# Altium schematic sheet Top.SchDoc
size Letter; DocumentNumber: 1; SheetNumber: 1; SheetTotal: 1; SPICEModelCacheXCQKSQWO: <root> / <DocumentId>XCQKSQWO</DocumentId> / </root>; DescLong1: Class: ESE3400; DescLong2_DescShort: Biopotential Amplifier for ECG
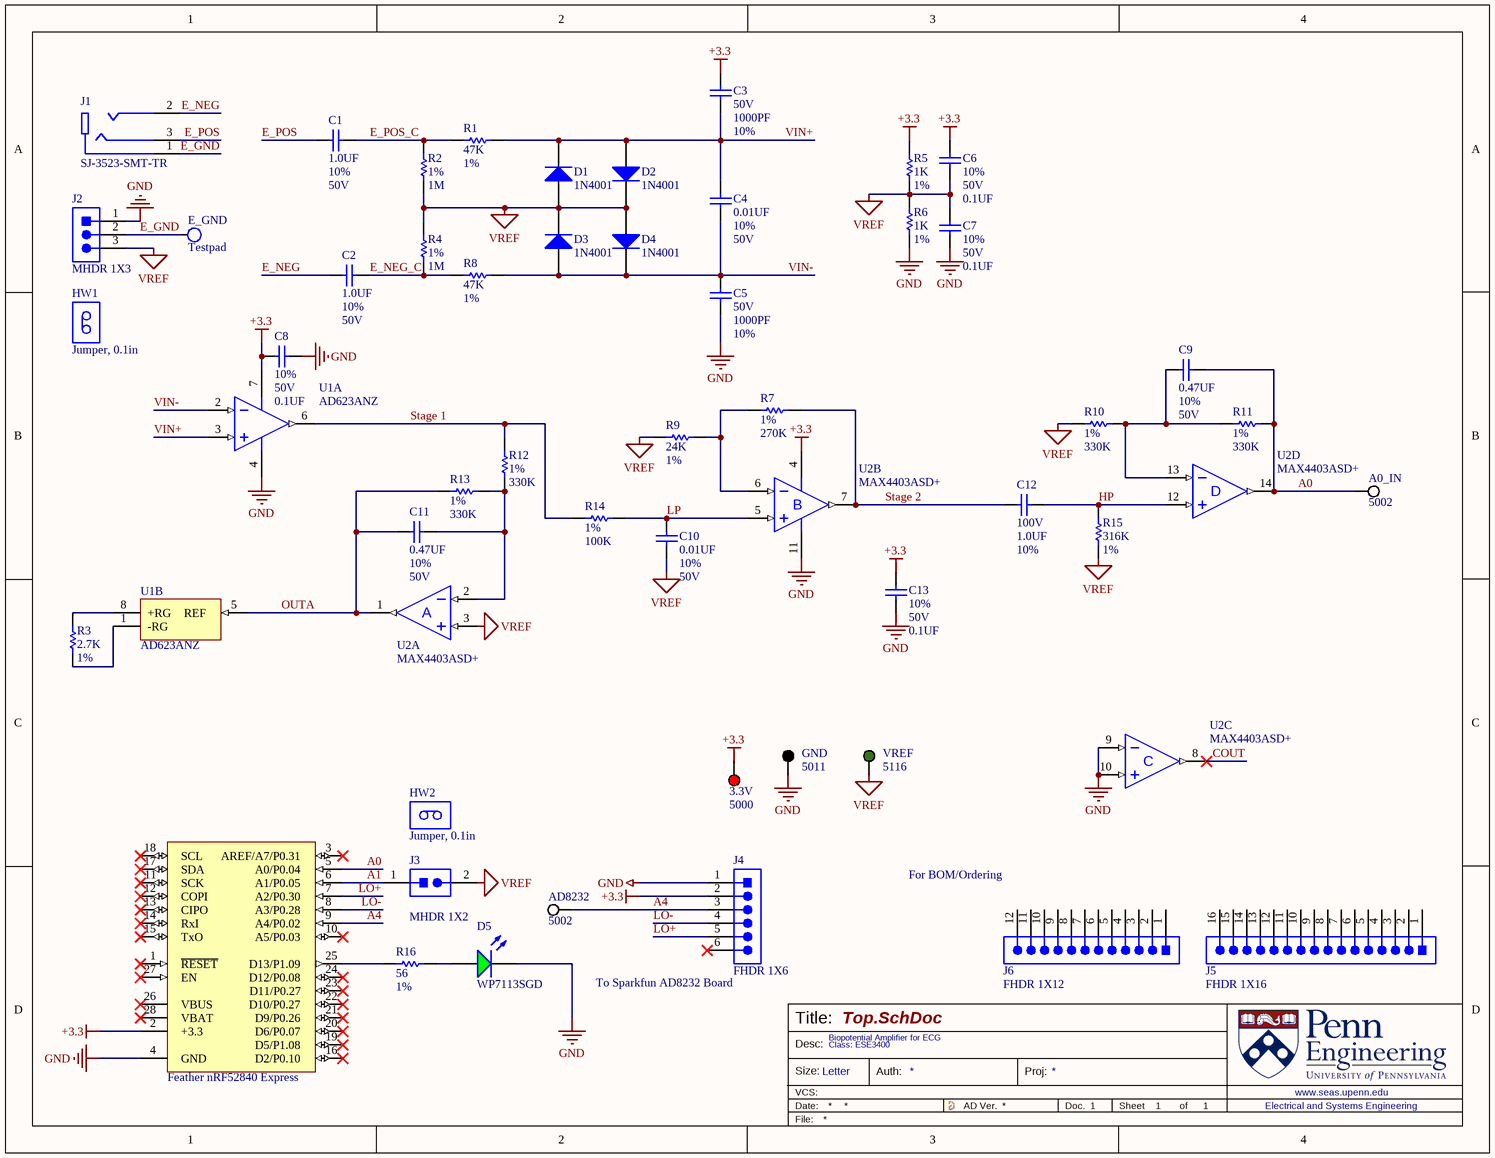
[diagram p0: Top.SchDoc]

## Parts
3.3V  5000  [KSTN-5000]
A0_IN  5002  [KSTN-5002]
A1  Feather nRF52840 Express  [4062-Stacking Headers]
AD8232  5002  [KSTN-5002]
C1  value 1.0UF  Tolerance: 10%  Voltage: 50V  [1206_CAP]  (hidden comment: CAP 1206 1.0UF 50V 10% X7R)
C2  value 1.0UF  Tolerance: 10%  Voltage: 50V  [1206_CAP]  (hidden comment: CAP 1206 1.0UF 50V 10% X7R)
C3  value 1000PF  Voltage: 50V  Tolerance: 10%  [1206_CAP]  (hidden comment: CAP 1206 1000PF 50V 10% X7R)
C4  value 0.01UF  Tolerance: 10%  Voltage: 50V  [1206_CAP]  (hidden comment: CAP 1206 0.01UF 50V 10% X7R)
C5  value 1000PF  Voltage: 50V  Tolerance: 10%  [1206_CAP]  (hidden comment: CAP 1206 1000PF 50V 10% X7R)
C6  value 0.1UF  Tolerance: 10%  Voltage: 50V  [1206_cap_35H]  (hidden comment: CAP 1206 0.1UF 50V 10% X7R)
C7  value 0.1UF  Tolerance: 10%  Voltage: 50V  [1206_cap_35H]  (hidden comment: CAP 1206 0.1UF 50V 10% X7R)
C8  value 0.1UF  Tolerance: 10%  Voltage: 50V  [1206_cap_35H]  (hidden comment: CAP 1206 0.1UF 50V 10% X7R)
C9  value 0.47UF  Tolerance: 10%  Voltage: 50V  [1206_CAP]  (hidden comment: CAP 1206 0.47UF 50V 10% X7R)
C10  value 0.01UF  Tolerance: 10%  Voltage: 50V  [1206_CAP]  (hidden comment: CAP 1206 0.01UF 50V 10% X7R)
C11  value 0.47UF  Tolerance: 10%  Voltage: 50V  [1206_CAP]  (hidden comment: CAP 1206 0.47UF 50V 10% X7R)
C12  value 1.0UF  Voltage: 100V  Tolerance: 10%  [1206_CAP]  (hidden comment: CAP 1206 1.0UF 100V 10% X7R)
C13  value 0.1UF  Tolerance: 10%  Voltage: 50V  [1206_cap_35H]  (hidden comment: CAP 1206 0.1UF 50V 10% X7R)
D1  1N4001  [DO-41 0.4in Spacing]
D2  1N4001  [DO-41 0.4in Spacing]
D3  1N4001  [DO-41 0.4in Spacing]
D4  1N4001  [DO-41 0.4in Spacing]
D5  WP7113SGD  [T-1 3/4 LED]
E_GND  Testpad  [Test PTH 15-30]  (no BOM)
GND  5011  [KSTN-5011_V]
HW1  Jumper, 0.1in  (mechanical)
HW2  Jumper, 0.1in  (mechanical)
J1  SJ-3523-SMT-TR  [SJ-3524-SMT-TR-Footprint-1]
J2  MHDR 1X3  [PH1-03-UA]
J3  MHDR 1X2  [PH1-02-UA]
J4  FHDR 1X6  [FHDR 1X6-Footprint-1]
J5  FHDR 1X16  [FHDR 1X16-Footprint-1]  (mechanical)
J6  FHDR 1X12  [M20-7821246-Footprint-1]  (mechanical)
R1  value 47K  Tolerance: 1%  [0805_RES]  (hidden comment: RES 0805 47K 1%)
R2  value 1M  Tolerance: 1%  [0805_RES]  (hidden comment: RES 0805 1M 1%)
R3  value 2.7K  Tolerance: 1%  [0805_RES]  (hidden comment: RES 0805 2.7K 1%)
R4  value 1M  Tolerance: 1%  [0805_RES]  (hidden comment: RES 0805 1M 1%)
R5  value 1K  Tolerance: 1%  [0805_RES]  (hidden comment: RES 0805 1K 1%)
R6  value 1K  Tolerance: 1%  [0805_RES]  (hidden comment: RES 0805 1K 1%)
R7  value 270K  Tolerance: 1%  [0805_RES]  (hidden comment: RES 0805 270K 1%)
R8  value 47K  Tolerance: 1%  [0805_RES]  (hidden comment: RES 0805 47K 1%)
R9  value 24K  Tolerance: 1%  [0805_RES]  (hidden comment: RES 0805 24K 1%)
R10  value 330K  Tolerance: 1%  [0805_RES]  (hidden comment: RES 0805 330K 1%)
R11  value 330K  Tolerance: 1%  [0805_RES]  (hidden comment: RES 0805 330K 1%)
R12  value 330K  Tolerance: 1%  [0805_RES]  (hidden comment: RES 0805 330K 1%)
R13  value 330K  Tolerance: 1%  [0805_RES]  (hidden comment: RES 0805 330K 1%)
R14  value 100K  Tolerance: 1%  [0805_RES]  (hidden comment: RES 0805 100K 1%)
R15  value 316K  Tolerance: 1%  [0805_RES]  (hidden comment: RES 0805 316K 1%)
R16  value 56  Tolerance: 1%  [0805_RES]  (hidden comment: RES 0805 56 1%)
U1  AD623ANZ  [DIP8-SOCKETED]  (parts A,B of 2)
U2  MAX4403ASD+  [AD8694ARZ-Footprint-1]  (parts A,B,C,D of 4)
VREF  5116  [KSTN-5116]

## Nets
+3.3: 3.3V.1 A1.2(+3.3) C3.2 C6.1 C8.1 C13.1 J4.2 R5.2 U1.7(V+) U2.4(V+)
GND: A1.4(GND) C5.1 C7.2 C8.2 C13.2 D5.K GND.1 J2.1 J4.1 R6.1 U1.4(V-) U2.9(IN3-) U2.10(IN3+) U2.11(GND)
VREF: C6.2 C7.1 C10.2 D1.A D2.K D3.K D4.A J2.3 J3.2 R2.1 R4.2 R5.1 R6.2 R9.1 R10.1 R15.1 U2.3(IN1+) VREF.1
A0: A0_IN.1 A1.5(A0/P0.04) C9.2 R11.2 U2.14(OUT4)
A1: A1.6(A1/P0.05) J3.1
A4: A1.9(A4/P0.02) AD8232.1 J4.3
COUT: U2.8(OUT3)
E_GND: E_GND.1 J1.1(Sleeve) J2.2
E_NEG: C2.1 J1.2(Tip)
E_NEG_C: C2.2 R4.1 R8.1
E_POS: C1.1 J1.3(Ring)
E_POS_C: C1.2 R1.1 R2.2
HP: C12.2 R15.2 U2.12(IN4+)
LO+: A1.7(A2/P0.30) J4.5
LO-: A1.8(A3/P0.28) J4.4
LP: C10.1 R14.1 U2.5(IN2+)
OUTA: C11.1 R13.1 U1.5(REF) U2.1(OUT1)
Stage 1: R12.2 R14.2 U1.6(OUT)
Stage 2: C12.1 R7.2 U2.7(OUT2)
VIN+: C3.1 C4.2 D1.K D2.A R1.2 U1.3(IN1+)
VIN-: C4.1 C5.2 D3.A D4.K R8.2 U1.2(IN1-)
NetA1_25: A1.25(D13/P1.09) R16.1
NetC9_1: C9.1 R10.2 R11.1 U2.13(IN4-)
NetC11_2: C11.2 R12.1 R13.2 U2.2(IN1-)
NetD5_A: D5.A R16.2
NetR3_1: R3.1 U1.1(-RG)
NetR3_2: R3.2 U1.8(+RG)
NetR7_1: R7.1 R9.2 U2.6(IN2-)

Not connected (* = marked no-connect by the designer): A1 1(~{RESET})* 3(AREF/A7/P0.31)* 10(A5/P0.03)* 11(SCK)* 12(COPI)* 13(CIPO)* 14(RxI)* 15(TxO)* 16(D2/P0.10)* 17(SDA)* 18(SCL)* 19(D5/P1.08)* 20(D6/P0.07)* 21(D9/P0.26)* 22(D10/P0.27)* 23(D11/P0.27)* 24(D12/P0.08)* 26(VBUS)* 27(EN)* 28(VBAT)*; J4 6*; J5 1 2 3 4 5 6 7 8 9 10 11 12 13 14 15 16; J6 1 2 3 4 5 6 7 8 9 10 11 12

## Notes on the sheet
- For BOM/Ordering
- (near J4) To Sparkfun AD8232 Board
- Title:
- Desc:
- Size:
- Letter
- Auth:
- Proj:
- Sheet
- of
- www.seas.upenn.edu
- Electrical and Systems Engineering
- (in symbol CMP-00048-4, part A) A
- (in symbol CMP-00048-4, part B) B
- (in symbol CMP-00048-4, part C) C
- (in symbol CMP-00048-4, part D) D

## Library data of the parts
3.3V = CMP-024-000000-1: Test Point, Red, 1-Pin THD, RoHS, Bulk; Brand: KeystoneElectronics; Mounting Hole Size: 1mm; Plating: Silver; Outside Diameter: 2.54mm; Source: Keystone 500x Series.SchLib; Contact Material: PhosphorBronze; Product Category: CircuitBoardHardware-PCB; Pin Count: 1; Color: Red; Component Type: Standard; Datasheet URL: https://ciiva.com/datasheet-click-2917627?src=ciiva&sig=bd195616; Manufacturer: KeystoneElectronics; Datasheet Version: Rev. G, 12/2008; Length: 7.62mm; Product: TestPoints; Packaging: Bulk; RoHS: True; Type: Miniature; Manufacturer URL: http://www.keyelco.com/; Material: Nylon; Design Item ID: 5000
A0_IN AD8232 = CMP-024-000002-1: Test Point, White, 1-Pin THD, RoHS, Bulk; Manufacturer: KeystoneElectronics; Mounting Hole Size: 1mm; Plating: Silver; Outside Diameter: 2.54mm; Product Category: CircuitBoardHardware-PCB; RoHS: True; Manufacturer URL: http://www.keyelco.com/; Packaging: Bulk; Source: Keystone 500x Series.SchLib; Component Type: Standard; Pin Count: 1; Material: Nylon; Datasheet Version: Rev. G, 12/2008; Design Item ID: 5002; Color: White; Product: TestPoints; Type: Miniature; Contact Material: PhosphorBronze; Datasheet URL: https://ciiva.com/datasheet-click-2917627?src=ciiva&sig=bd195616; Length: 7.62mm; Brand: KeystoneElectronics
A1 = CMP-000013-3: Adafruit Feather nRF52840 Express (4062); ComponentLink2Description: Module Link; ComponentLink1URL: https://learn.adafruit.com/introducing-the-adafruit-nrf52840-feather/overview; ComponentLink1Description: helpURL; ComponentLink2URL: https://www.raytac.com/product/ins.php?index_id=24
C1 C2 = CMP-011-000623-1: Capacitor Surface Mount 1206 Footprint 1.0UF 50V 10% Tolerance Ceramic X7R; Manufacturer: Various; Description in Visual: Cap SMT 1206 1.0UF 50V 10%  Cer X7R; PCB Package: 1206; Mount: SMT; Type: Ceramic X7R; Manufacturer P/N: CAP 1206 1.0UF 50V 10% X7R; P/N: CAP 1206 1.0UF 50V 10% X7R
C3 C5 = CMP-011-000635-1: Capacitor Surface Mount 1206 Footprint 1000PF 50V 10% Tolerance Ceramic X7R; Manufacturer: Various; PCB Package: 1206; Description in Visual: Cap SMT 1206 1000PF 50V 10%  Cer X7R; P/N: CAP 1206 1000PF 50V 10% X7R; Mount: SMT; Manufacturer P/N: CAP 1206 1000PF 50V 10% X7R; Type: Ceramic X7R
C4 C10 = CMP-011-000556-1: Capacitor Surface Mount 1206 Footprint 0.01UF 50V 10% Tolerance Ceramic X7R; Manufacturer: Various; Description in Visual: Cap SMT 1206 0.01UF 50V 10%  Cer X7R; PCB Package: 1206; Mount: SMT; P/N: CAP 1206 0.01UF 50V 10% X7R; Type: Ceramic X7R; Manufacturer P/N: CAP 1206 0.01UF 50V 10% X7R
C6-C8 C13 = CMP-011-000588-1: Capacitor Surface Mount 1206 Footprint 0.1UF 50V 10% Tolerance Ceramic X7R; Manufacturer: KEMET; Manufacturer P/N: C1206C104K5RAC7800; Description in Visual: Cap SMT 1206 0.1UF 50V 10%  Cer X7R; PCB Package: 1206; Mount: SMT; P/N: CAP 1206 0.1UF 50V 10% X7R; Type: Ceramic X7R
C9 C11 = CMP-011-000608-1: Capacitor Surface Mount 1206 Footprint 0.47UF 50V 10% Tolerance Ceramic X7R; Manufacturer: Various; Description in Visual: Cap SMT 1206 0.47UF 50V 10%  Cer X7R; PCB Package: 1206; Manufacturer P/N: CAP 1206 0.47UF 50V 10% X7R; Mount: SMT; Type: Ceramic X7R; P/N: CAP 1206 0.47UF 50V 10% X7R
C12 = CMP-011-000618-1: Capacitor Surface Mount 1206 Footprint 1.0UF 100V 10% Tolerance Ceramic X7R; Manufacturer: Various; Description in Visual: Cap SMT 1206 1.0UF 100V 10%  Cer X7R; PCB Package: 1206; P/N: CAP 1206 1.0UF 100V 10% X7R; Manufacturer P/N: CAP 1206 1.0UF 100V 10% X7R; Type: Ceramic X7R; Mount: SMT
D1-D4 = CMP-004-00001-1: Rectifier Diode, 1 Phase, 1 Element, 1A, 50V V(RRM), Silicon, DO-41; Time @ Peak Reflow Temperature-Max (s): 40s; Qualification Status: Not Qualified; Surface Mount: No; Number of Elements: 1; Case Connection: Isolated; Package Body Material: Plastic; Forward Voltage-Max (VF): 1V; Non-rep Pk Forward Current-Max: 30A; Diode Type: RECTIFIER; Terminal Finish: Tin; Max Operating Temperature: 150°C; REACH SVHC: No SVHC; Moisture Sensitivity Level: 1; Package Shape: Round; Peak Reflow Temperature (Cel): 260°C; Terminal Form: Wire; RoHS Compliant: Yes; Max Output Current: 1A; Diode Element Material: SILICON; Rep Pk Reverse Voltage-Max: 50V; Min Operating Temperature: -65°C; JESD-30 Code: O-PALF-W2; Number of Pins: 2; Terminal Position: AXIAL; JESD-609 Code: e3; JEDEC-95 Code: DO-41; Package Style: LONG FORMMeter
D5 = CMP-00016-1: Single Color LED, Super Bright Green, Diffused Green, T-1 3/4, 5mm; Wavelength - Peak: 565nm; Millicandela Rating: 40mcd; Wavelength - Dominant: 568nm; Forward Voltage: 2.2V; Current: 20mA; Package (Case): T-1 3/4; Color: Green
E_GND = CMP-00049-1: Test Pad/Point; Pin Count: 1
GND = CMP-024-000010-1: Large THT Test Point, Black
HW1 HW2 = CMP-00051-1: 2 (1 x 2) Position Shunt Connector, No Grip 0.100" (2.54mm) Gold
J1 = CMP-000039-1: 3 Pole(s), Female, Surface Mount Terminal, Locking, Jack; Board Mounting Option: PEG; Additional Feature: Low Profile; IEC Conformance: No; Number Of Connectors: 1; Option: General Purpose; Number of Poles: 3; Reliability: COMMERCIAL; Body Length: 0.236inch; Audio Type: STEREO; Contact Resistance: 50mR; Durability: 5000Cycles; Body Depth: 0.669inch; Rated Current (Signal): 1A; Connector Type: AUDIO/RCA CONNECTOR; Contact Style: RND PIN-SKT; Insulation Resistance: 100MR; Polarization Key: POLAR PIN POSITION; Body Breadth: 0.197inch; Dielectric Withstanding Voltage (AC): 500V; REACH SVHC: Yes; Body/Shell Style: JACK; Mount: Board; Contact Gender: Female; Contact Finish - Termination: Silver (Ag); Number of Ports: 1; DIN Conformance: No; RoHS Compliant: Yes; Max Operating Temperature: 85°C; Mounting Option 1: LOCKING; Mounting Style: RIGHT ANGLE; JESD-609 Code: e4; Contact Material: Copper Alloy; Insulation Color: Black; Termination: SMD/SMT; Min Operating Temperature: -25°C; MIL Conformance: No; Contact Finish - Mating: SILVER
J2 = CMP-000023-1: Header, 3-Pin, 0.1in Pitch, Male
J3 = CMP-000021-1: Header, 2-Pin, 0.1in Pitch, Male
J4 = CMP-000043-2: Board Connector, 6 Contact(s), 1 Row(s), Female, Straight, 0.1 inch Pitch, Solder Terminal, Locking, Black Insulator, Socket; DIN Conformance: No; Number of Rows Loaded: 1; Contact Resistance: 20mR; Polarization Key: POLARIZED HOUSING; Reference Standard: UL; PCB Contact Pattern: RECTANGULAR; Insulation Resistance: 1GR; Option: General Purpose; Body Breadth: 0.098inch; Contact Style: SQ PIN-SKT; Dielectric Withstanding Voltage (AC): 1kV; Durability: 300Cycles; Body Length: 0.6inch; Reliability: COMMERCIAL; Rated Current (Signal): 3A; Body Depth: 0.335inch; Number of Contacts: 6; Insulation Material: Polyamide; Termination: Solder; IEC Conformance: No; Contact Finish - Mating: GOLD; Max Operating Temperature: 105°C; Filter Feature: No; Number Of PCB Rows: 1; Body/Shell Style: SOCKET; Contact Finish - Termination: Tin (Sn) - with Nickel (Ni) barrier; Insulation Color: Black; Mounting Style: STRAIGHT; REACH SVHC: Yes; Number Of Connectors: 1; RoHS Compliant: Yes; Mounting Option 1: LOCKING; Terminal Pitch: 2.54mm; Contact Pattern: RECTANGULAR; Flammability Rating: UL94 V-0; Connector Type: BOARD CONNECTOR; MIL Conformance: No; Contact Gender: Female; Min Operating Temperature: -40°C; Mating Contact Pitch: 0.1inch; Mount: Board; JESD-609 Code: e3; Terminal Length: 0.118inch; Mixed Contacts: No
J5 = CMP-000042-2: Header, 16-Pin, 0.1in Pitch, Female; MIL Conformance: No; Contact Pattern: RECTANGULAR; Body Depth: 0.335inch; Dielectric Withstanding Voltage (AC): 1kV; Number Of PCB Rows: 1; Polarization Key: POLARIZED HOUSING; Option: General Purpose; Connector Type: BOARD CONNECTOR; Contact Style: SQ PIN-SKT; Mating Contact Pitch: 0.1inch; Body Length: 1.6inch; Mounting Option 1: LOCKING; Body Breadth: 0.098inch; Rated Current (Signal): 3A; Contact Resistance: 20mR; Number of Contacts: 16; Durability: 300Cycles; Reference Standard: UL; Reliability: COMMERCIAL; Body/Shell Style: SOCKET; Insulation Resistance: 1GR; Contact Gender: Female; Max Operating Temperature: 105°C; DIN Conformance: No; RoHS Compliant: Yes; Contact Finish - Mating: TIN; JESD-609 Code: e3; REACH SVHC: Yes; IEC Conformance: No; Number Of Connectors: 1; Flammability Rating: UL94 V-0; Mount: Board; Terminal Length: 0.118inch; Termination: Solder; Insulation Color: Black; Insulation Material: Polyamide; Number of Rows Loaded: 1; Mixed Contacts: No; Contact Finish - Termination: Tin (Sn) - with Nickel (Ni) barrier; Filter Feature: No; Terminal Pitch: 2.54mm; PCB Contact Pattern: RECTANGULAR; Min Operating Temperature: -40°C; Mounting Style: STRAIGHT
J6 = CMP-002-00002-2: Board Connector, 12 Contact(s), 1 Row(s), Female, Straight, 0.1 inch Pitch, Solder Terminal, Locking, Black Insulator, Socket; Contact Resistance: 20mR; Durability: 300Cycles; Body Breadth: 0.098inch; Reference Standard: UL; Body Length: 1.2inch; PCB Contact Pattern: RECTANGULAR; Mixed Contacts: No; Contact Style: SQ PIN-SKT; Number of Contacts: 12; Reliability: COMMERCIAL; Dielectric Withstanding Voltage (AC): 1kV; Rated Current (Signal): 3A; Body Depth: 0.335inch; Option: General Purpose; Polarization Key: POLARIZED HOUSING; Insulation Resistance: 1GR; Number of Rows Loaded: 1; Min Operating Temperature: -40°C; Contact Gender: Female; JESD-609 Code: e3; Mount: Board; MIL Conformance: No; Contact Pattern: RECTANGULAR; Mounting Style: STRAIGHT; Flammability Rating: UL94 V-0; Connector Type: BOARD CONNECTOR; Body/Shell Style: SOCKET; Insulation Color: Black; Contact Finish - Mating: TIN; REACH SVHC: Yes; DIN Conformance: No; RoHS Compliant: Yes; Terminal Pitch: 2.54mm; Max Operating Temperature: 105°C; Terminal Length: 0.118inch; Mating Contact Pitch: 0.1inch; Filter Feature: No; Mounting Option 1: LOCKING; IEC Conformance: No; Termination: Solder; Contact Finish - Termination: Tin (Sn) - with Nickel (Ni) barrier; Insulation Material: Polyamide; Number Of PCB Rows: 1; Number Of Connectors: 1
R1 R8 = CMP-005-005155-1: Resistor Surface Mount, 47K Ohms, 0805 Footprint, 1% Tolerance 0.125W; Manufacturer: Various; PCB Package: 0805; Description in Visual: Res SMT 47K 0805  1%  0.125W; Mount: SMT; Manufacturer P/N: RES 0805 47K 1%; Power Rating: 0.125W
R2 R4 = CMP-005-004402-1: Resistor Surface Mount, 1M Ohms, 0805 Footprint, 1% Tolerance 0.125W; Manufacturer: Various; Description in Visual: Res SMT 1M 0805  1%  0.125W; PCB Package: 0805; Power Rating: 0.125W; Manufacturer P/N: RES 0805 1M 1%; Mount: SMT
R3 = CMP-005-004468-1: Resistor Surface Mount, 2.7K Ohms, 0805 Footprint, 1% Tolerance 0.125W; Manufacturer: Various; Description in Visual: Res SMT 2.7K 0805  1%  0.125W; PCB Package: 0805; Manufacturer P/N: RES 0805 2.7K 1%; Power Rating: 0.125W; Mount: SMT
R5 R6 = CMP-005-004398-1: Resistor Surface Mount, 1K Ohms, 0805 Footprint, 1% Tolerance 0.125W; Manufacturer: Various; PCB Package: 0805; Description in Visual: Res SMT 1K 0805  1%  0.125W; Mount: SMT; Power Rating: 0.125W; Manufacturer P/N: RES 0805 1K 1%
R7 = CMP-005-004676-1: Resistor Surface Mount, 270K Ohms, 0805 Footprint, 1% Tolerance 0.125W; Manufacturer: Various; PCB Package: 0805; Description in Visual: Res SMT 270K 0805  1%  0.125W; Manufacturer P/N: RES 0805 270K 1%; Mount: SMT; Power Rating: 0.125W
R9 = CMP-005-004622-1: Resistor Surface Mount, 24K Ohms, 0805 Footprint, 1% Tolerance 0.125W; Manufacturer: Various; PCB Package: 0805; Description in Visual: Res SMT 24K 0805  1%  0.125W; Manufacturer P/N: RES 0805 24K 1%; Mount: SMT; Power Rating: 0.125W
R10-R13 = CMP-005-004871-1: Resistor Surface Mount, 330K Ohms, 0805 Footprint, 1% Tolerance 0.125W; Manufacturer: Various; PCB Package: 0805; Description in Visual: Res SMT 330K 0805  1%  0.125W; Mount: SMT; Manufacturer P/N: RES 0805 330K 1%; Power Rating: 0.125W
R14 = CMP-005-004027-1: Resistor Surface Mount, 100K Ohms, 0805 Footprint, 1% Tolerance 0.125W; Manufacturer: Various; Description in Visual: Res SMT 100K 0805  1%  0.125W; PCB Package: 0805; Mount: SMT; Power Rating: 0.125W; Manufacturer P/N: RES 0805 100K 1%
R15 = CMP-005-004841-1: Resistor Surface Mount, 316K Ohms, 0805 Footprint, 1% Tolerance 0.125W; Manufacturer: Various; PCB Package: 0805; Description in Visual: Res SMT 316K 0805  1%  0.125W; Power Rating: 0.125W; Manufacturer P/N: RES 0805 316K 1%; Mount: SMT
R16 = CMP-005-005284-1: Resistor Surface Mount, 56 Ohms, 0805 Footprint, 1% Tolerance 0.125W; Manufacturer: Various; Manufacturer P/N: RES 0805 56R 1%; Description in Visual: Res SMT 56 0805  1%  0.125W; PCB Package: 0805; Power Rating: 0.125W; Mount: SMT
U1 = CMP-00046-1: Instrumentation Amplifier, 1 Func, 350uV Offset-Max, 0.8MHz Band Width, PDIP8; Supply Voltage Limit-Max: 6V; Qualification Status: Not Qualified; Surface Mount: No; Bandwidth (3dB)-Nom: 800kHz; Neg Supply Voltage-Nom (Vsup): -5V; Package Body Material: Plastic; Average Bias Current-Max (IIB): 27.5nA; Number of Functions: 1; Package Equivalence Code: DIP8,.3; Time @ Peak Reflow Temperature-Max (s): 30s; Input Offset Current-Max (IIO): 2.5nA; Neg Supply Voltage Limit-Max: -6V; Max Supply Current: 625uA; Power Supplies: 5V; Voltage Gain-Max: 1000; Common Mode Rejection Ratio-Min: 70dB; Slew Rate: 0.3V/µs; Temperature Grade: INDUSTRIAL; Package Shape: Rectangular; RoHS Compliant: Yes; Terminal Position: DUAL; JESD-609 Code: e3; Terminal Pitch: 2.54mm; Terminal Form: Through Hole; Terminal Finish: Tin; Package Style: IN-LINEMeter; Amplifier Type: INSTRUMENTATION AMPLIFIER; Input Offset Voltage-Max: 350uV; Length: 9.88mm; REACH SVHC: Yes; Moisture Sensitivity Level: 1; Width: 7.62mm; Peak Reflow Temperature (Cel): 260°C; Voltage Gain-Min: 1; Height - Seated (Max): 5.33mm; JESD-30 Code: R-PDIP-T8; Supply Voltage-Nom (Vsup): 5V; Min Operating Temperature: -40°C; Package Code: DIP; Max Operating Temperature: 85°C; Number of Pins: 8
U2 = CMP-00048-4: Operational Amplifier, 4 Func, 8000uV Offset-Max, CMOS, PDSO14; Unity Gain BW-Nom: 800kHz; Number of Functions: 4; Neg Supply Voltage-Nom (Vsup): 0V; Max Supply Current: 3.2mA; Slew Rate: 1V/µs; Qualification Status: Not Qualified; Time @ Peak Reflow Temperature-Max (s): 30s; Package Body Material: Plastic; Low-Bias: Yes; Bias Current-Max (IIB) @25C: 100pA; Package Equivalence Code: SOP14,.25; Power Supplies: 5V; Common-mode Reject Ratio-Nom: 84dB; Low-Offset: No; Voltage Gain-Min: 17780; Supply Voltage Limit-Max: 6V; Architecture: VOLTAGE-FEEDBACK; Input Offset Voltage-Max: 8mV; RoHS Compliant: Yes; Moisture Sensitivity Level: 1; Peak Reflow Temperature (Cel): 260°C; Package Code: SOP; Terminal Finish: Tin; Number of Pins: 14; JESD-30 Code: R-PDSO-G14; Surface Mount: Yes; JESD-609 Code: e3; Min Operating Temperature: -40°C; Amplifier Type: OPERATIONAL AMPLIFIER; Package Shape: Rectangular; Package Style: SMALL OUTLINEMeter; Max Operating Temperature: 125°C; Length: 8.65mm; Terminal Pitch: 1.27mm; Micropower: Yes; Terminal Position: DUAL; Average Bias Current-Max (IIB): 100pA; Width: 3.9mm; Temperature Grade: AUTOMOTIVE; Supply Voltage-Nom (Vsup): 5V; Height - Seated (Max): 1.75mm; REACH SVHC: Yes; Frequency Compensation: YES; Neg Supply Voltage Limit-Max: 0V; Technology: CMOS; Terminal Form: Gull Wing
VREF = CMP-024-000006-1: Test Point, Green, 1-Pin THD, RoHS, Bulk; Brand: KeystoneElectronics; Mounting Hole Size: 1mm; Outside Diameter: 2.54mm; Plating: Silver; Product Category: CircuitBoardHardware-PCB; Contact Material: PhosphorBronze; Pin Count: 1; Packaging: Bulk; Datasheet URL: https://ciiva.com/datasheet-click-2917627?src=ciiva&sig=bd195616; Material: Nylon; Length: 7.62mm; Type: Miniature; Datasheet Version: Rev. G, 12/2008; Component Type: Standard; Design Item ID: 5116; Product: TestPoints; Source: Keystone 500x Series.SchLib; Color: Green; RoHS: True; Manufacturer URL: http://www.keyelco.com/; Manufacturer: KeystoneElectronics